# Altium project Dashboard r4.PrjPcb
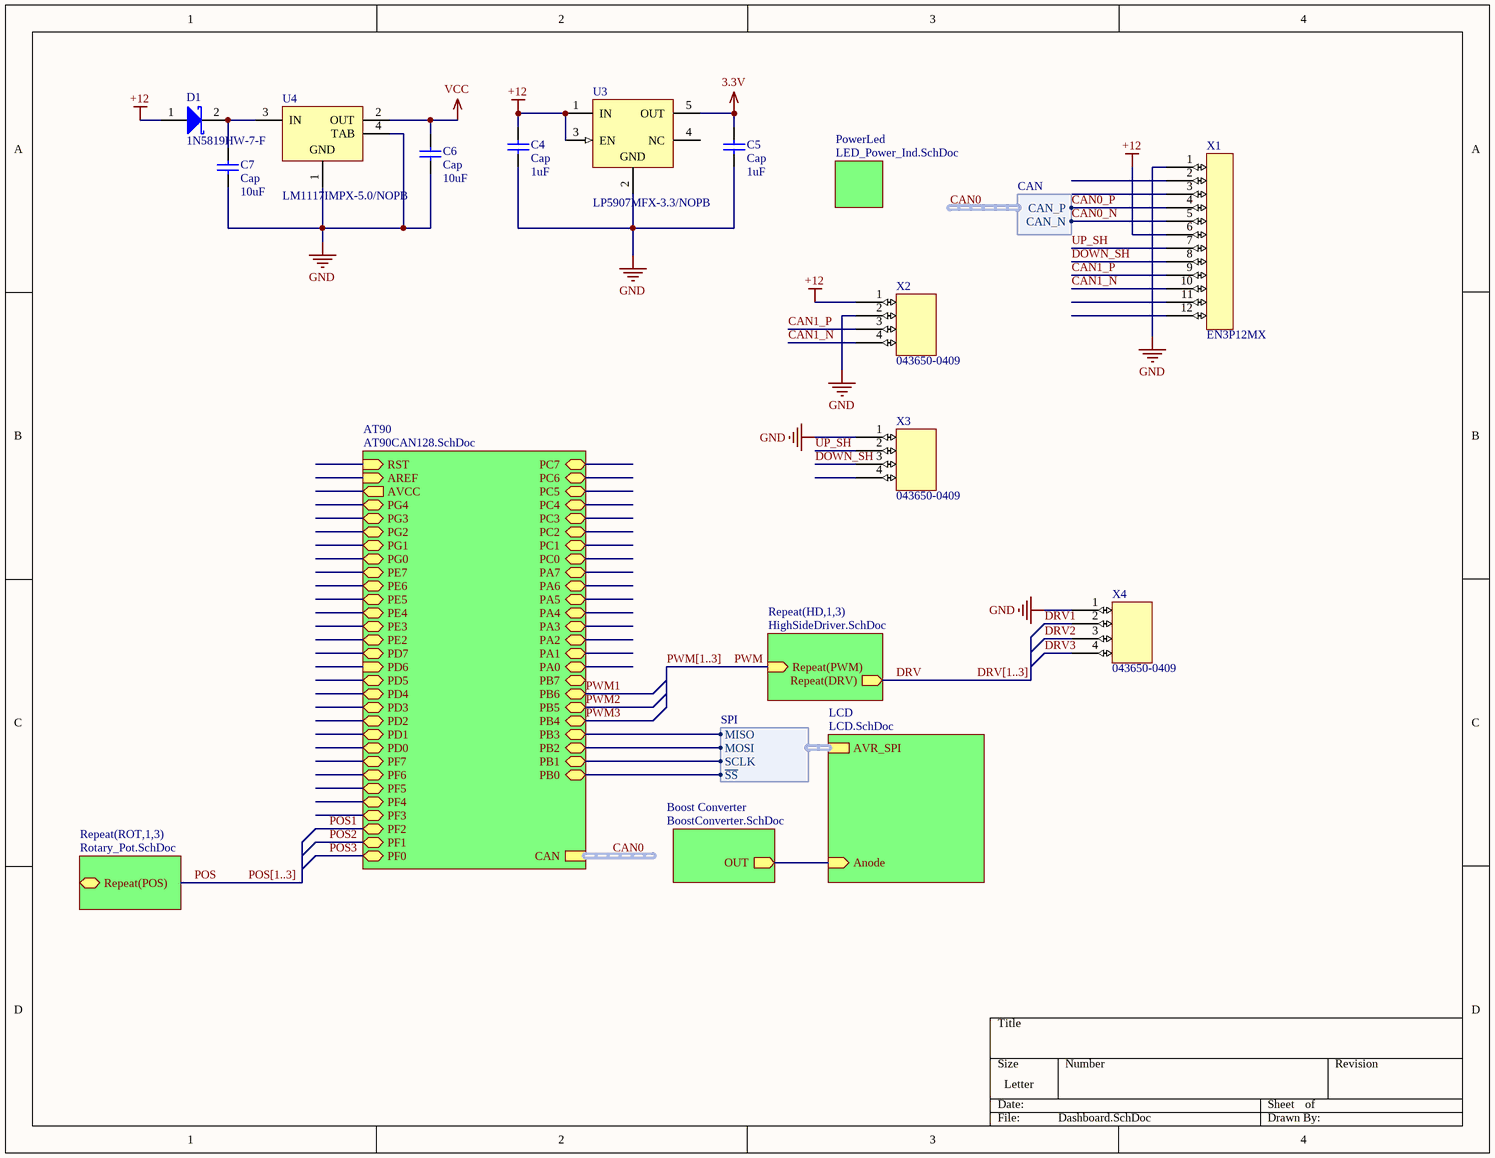
[diagram p0: Dashboard.SchDoc]
9 sheets, 75 parts. Net scope: hierarchical (ports join the sheet entries above them; power ports are global).
Board file: Dashboard.PcbDoc
Sheets:
  Dashboard.SchDoc
    HD1 = HighSideDriver.SchDoc
    HD2 = HighSideDriver.SchDoc
    HD3 = HighSideDriver.SchDoc
    LCD = LCD.SchDoc
    PowerLed = LED_Power_Ind.SchDoc
    AT90 = AT90CAN128.SchDoc
      Int = FTDI_Interface.SchDoc
      CAN = CAN_Interface.SchDoc
      ResetCkt = ResetCkt.SchDoc
    Boost Converter = BoostConverter.SchDoc

## Sheet Dashboard.SchDoc
size Letter

### Parts
C4  Cap  value 1uF  [1608[0603]]
C5  Cap  value 1uF  [1608[0603]]
C6  Cap  value 10uF  [1608[0603]]
C7  Cap  value 10uF  [1608[0603]]
D1  1N5819HW-7-F  [DIOD-SOD-123-2_V]
U3  LP5907MFX-3.3/NOPB  [DBV0005A_L]
U4  LM1117IMPX-5.0/NOPB  [MP04A_M]
X1  EN3P12MX  [EN3P12MX]
X2  043650-0409  [043650-0409]
X3  043650-0409  [043650-0409]
X4  043650-0409  [043650-0409]

### Sub-sheets
AT90 = AT90CAN128.SchDoc: PD6 (in), PD5 (bidir), RST (in), AREF (in), AVCC (out), PG2 (bidir), PG1 (bidir), PG0 (bidir), PE7 (bidir), PE6 (bidir), PE5 (bidir), PE4 (bidir), PE3 (bidir), PE2 (bidir), PD7 (bidir), PD4 (bidir), PD3 (bidir), PD2 (bidir), PD1 (bidir), PD0 (bidir), PF7 (bidir), PF6 (bidir), PF5 (bidir), PF4 (bidir), PF3 (bidir), PF2 (bidir), PF1 (bidir), PF0 (bidir), PC7 (bidir), PC6 (bidir), PC5 (bidir), PC4 (bidir), PC3 (bidir), PC2 (bidir), PC1 (bidir), PC0 (bidir), PA7 (bidir), PA6 (bidir), PA5 (bidir), PA4 (bidir), PA0 (bidir), PG4 (bidir), PA3 (bidir), PA2 (bidir), PB7 (bidir), PB6 (bidir), PA1 (bidir), PG3 (bidir), PB5 (bidir), PB4 (bidir), PB3 (bidir), PB2 (bidir), PB1 (bidir), PB0 (bidir), CAN (harness CAN)
Boost Converter = BoostConverter.SchDoc: OUT (out)
LCD = LCD.SchDoc: Anode (in), AVR_SPI (harness SPI)
PowerLed = LED_Power_Ind.SchDoc: no entries
Repeat(HD,1,3) = HighSideDriver.SchDoc: Repeat(PWM) (in), Repeat(DRV) (out)
Repeat(ROT,1,3) = Rotary_Pot.SchDoc (file not in this document): Repeat(POS) (bidir)

### Harnesses
SPI: ~{SS}, MISO, MOSI, SCLK
CAN: CAN_N, CAN_P

### Nets
3.3V: C5.1 U3.5(OUT)
+12: C4.1 D1.1(A) U3.1(IN) U3.3(EN) X1.6 X2.1
GND: C4.2 C5.2 C6.2 C7.2 U3.2(GND) U4.1(GND) U4.4(TAB) X1.1 X2.2 X3.1 X4.1
VCC: C6.1 U4.2(OUT)
CAN0_N: X1.5 ; sheet AT90/CAN.CAN_N  [project net CAN0.CAN_N]
CAN0_P: X1.4 ; sheet AT90/CAN.CAN_P  [project net CAN0.CAN_P]
CAN1_N: X1.10 X2.4
CAN1_P: X1.9 X2.3
DOWN_SH: X1.8 X3.3
DRV: sheet Repeat(HD,1,3)/Repeat(DRV)
DRV1: X4.2
DRV2: X4.3
DRV3: X4.4
PWM: sheet Repeat(HD,1,3)/Repeat(PWM)
UP_SH: X1.7 X3.2
NetC7_1: C7.1 D1.2(K) U4.3(IN)
NetC17_2: sheet LCD/Anode, sheet Boost Converter/OUT
NetU1#2_10: sheet AT90/PB0, sheet LCD/AVR_SPI.~{SS}
NetU1#2_11: sheet AT90/PB1, sheet LCD/AVR_SPI.SCLK
NetU1#2_12: sheet AT90/PB2, sheet LCD/AVR_SPI.MOSI
NetU1#2_13: sheet AT90/PB3, sheet LCD/AVR_SPI.MISO

Not connected (* = marked no-connect by the designer): U3 4(NC); X1 2 3 11 12; X3 4

### Buses and harness runs
bus DRV[1..3]
bus POS[1..3]
bus PWM[1..3]
harness CAN0 = sheet AT90/CAN

### Library data of the parts
C4-C7 = Cap: Capacitor; Published: 8-Jun-2000; LatestRevisionDate: 17-Jul-2002; LatestRevisionNote: Re-released for DXP Platform.; PackageReference: RAD-0.3; Publisher: Altium Limited; PackageDescription: Radial Cap, Thru-Hole; 2 Leads; 0.3 in Pin Spacing
D1 = CMP-0303-00003-1: 1.0 A Surface Mount Schottky Barrier Rectifier, 40 V, -65 to 125 degC, 2-Pin SOD-123 Package, RoHS, Tape and Reel; Manufacturer: Diodes Inc; @ VR (V): 40; @ Terminal Temperature TT (degC): 90; Maximum Average Rectified Current IO (A): 1; Total Capacitance CT (pF): 50; Peak Forward Surge Current IFSM (A): 25; Forward Voltage Drop VF (V): 0.45; VR (RMS) (V): 28; RoHS: TRUE; PartNumber: 1N5819HW-7-F; ComponentLink2URL: http://www.diodes.com/datasheets/ds30217.pdf; PackageDescription: 2-Pin SOD-123, Body 2.7 x 1.55 mm, Pitch 3.7 mm; @ IF (A): 1; Operating and Storage Temperature Range: -65 to 125 degC; ComponentLink1Description: Manufacturer URL; ComponentLink2Description: Datasheet; ComponentLink1URL: http://www.diodes.com/; Mounting Technology: Surface Mount; DatasheetVersion: Rev. 15-2; PackageReference: SOD-123-2; Maximum Reverse Current IR (uA): 50; Peak Repetitive Reverse Voltage VRRM (V): 40; Packing: Tape and Reel
U3 = CMP-2000-07464-1: Ultra-Low-Noise, Low-IQ LDO, 0.25 A, Fixed 3.3 V Output, 2.2 to 5.5 V Input, -40 to 125 degC, 5-Pin SOT-23 (DBV), Green (RoHS & no Sb/Br), Tape and Reel; Manufacturer: Texas Instruments; Max Output Current: 250mA; Max Input Voltage: 5.5V; Dropout Voltage: 250mV; Number of Regulators: 1; Nominal Output Voltage: 3.3V; Output Voltage Accuracy: 2%; Polarity: Positive; Min Input Voltage: 2.2V; Package Version: 4073253-4/N, 12/2014; Quiescent Current: 425uA; Power Supply Rejection Ratio (PSRR): 82dB; Case\/Package: SOT-23; Lead Free: LeadFree; Package Reference: DBV5; Output Current: 250mA; Package Description: 5-Pin Small Outline Transistor, Body 2.9 x 1.6 mm, Pitch 0.95 mm; Max Operating Temperature: 125degC; Mounting Technology: SurfaceMount; Number of Pins: 5; Mount: SurfaceMount; Manufacturer URL: http://www.ti.com/; Accuracy: 2%; Package URL: http://www.ti.com/lit/ml/mpds018l/mpds018l.pdf; Output Voltage: 3.3V; Radiation Hardening: No; Number of Outputs: 1; Packaging: TapeandReel; RoHSCompliant: true; Min Operating Temperature: -40degC; Datasheet URL: http://www.ti.com/lit/ds/symlink/lp5907.pdf; Package Quantity: 3000; Datasheet Version: Rev. L, 09/2016; REACH SVHC: NoSVHC; Contact Plating: Tin
U4 = CMP-0062-01628-3: 800mA Low-Dropout Linear Regulator, 4-pin SOT-223, Pb-Free; Manufacturer: National Semiconductor; CompType: LDO IC; High-Reliability: Y; PackageTopMarking: XYTT*N06B; PowerWise: N; ComponentLink3Description: LM1117 Web Page; ComponentLink3URL: http://www.national.com/pf/LM/LM1117.html; DatasheetVersion: Apr-2006; ComponentLink2Description: LM1117 Datasheet; PackageVersion: revB, Apr-2003; ComponentLink4Description: MP04A Package Page; ComponentLink1Description: Manufacturer URL; PartNumber: LM1117IMPX-5.0/NOPB; ComponentLink1URL: http://www.national.com/; PackageReference: MP04A; ComponentLink2URL: http://www.national.com/ds/LM/LM1117.pdf; PinCount: 4; Code_JEDEC: TO-261-AA; RevisionNote: SCH symbol layout adjusted; ComponentLink4URL: http://www.national.com/packaging/folders/mp04a.html; RoHS: Y; Code_IPC: SOT223-4; PackageDescription: Molded SOT-223, 6.50 x 3.56 x 1.6mm Body, 4 Lead, 2.3mm Pitch

## Sheet HighSideDriver.SchDoc
size A
Used 3 times, as channels HD1, HD2, HD3. Parts and nets are listed once, with the designators drawn on the sheet.
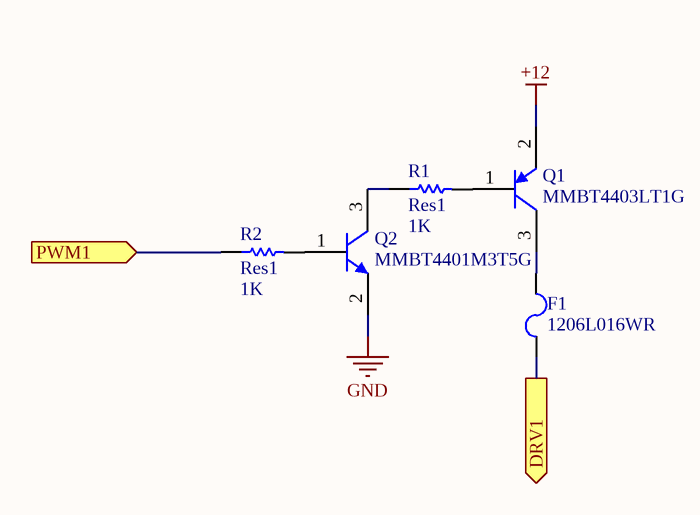
[diagram p1: HighSideDriver.SchDoc]

### Parts
F1  1206L016WR  [LFUS-1206L016WR_V]
Q1  MMBT4403LT1G  [ONSC-SOT-23-3-318-08_V]
Q2  MMBT4401M3T5G  [ONSC-SOT-23-3-318-08_V]
R1  Res1  value 1K  [J1-0603]
R2  Res1  value 1K  [J1-0603]

### Ports
DRV1 (out), PWM1 (in)

### Nets
+12: Q1.2(E)
GND: Q2.2(E)
DRV1: F1.1 ; port DRV1
PWM1: R2.1 ; port PWM1
NetF1_2: F1.2 Q1.3(C)
NetQ1_1: Q1.1(B) R1.2
NetQ2_1: Q2.1(B) R2.2
NetQ2_3: Q2.3(C) R1.1

### Channels
HD1: designators end in _HD1; ports DRV1=NetF1_HD1_1 PWM1=NetR2_HD1_1
HD2: designators end in _HD2; ports DRV1=NetF1_HD2_1 PWM1=NetR2_HD2_1
HD3: designators end in _HD3; ports DRV1=NetF1_HD3_1 PWM1=NetR2_HD3_1

### Library data of the parts
F1 = CMP-2000-05471-1: Resettable Fuse, 30 V, 100 A, 4.5 Ohm, -40 to 85 degC, 1206 (3216 Metric), RoHS, Tape and Reel; Manufacturer: Littelfuse; Hold Current [Ih]: 0.16A; Trip Current: 0.37A; Working Voltage-Max: 30V; Datasheet Version: 08/2016; Size: 1206; Manufacturer URL: http://www.littelfuse.com/; Datasheet URL: http://www.littelfuse.com/~/media/electronics/datasheets/resettable_ptcs/littelfuse_ptc_1206l_datasheet.pdf.pdf; Mounting Technology: SurfaceMount; Package Reference: 1206L016WR; Package Description: 2-Pin Surface Mount Device, Body 3.2 x 1.65 mm, Height 1.45 mm (Max); Operating Temp Range: -40to+85°C
Q1 = CMP-1048-00539-1: Switching Transistor, PNP Silicon, 3-Pin SOT-23, Pb-Free, Tape and Reel; Manufacturer: On Semiconductor; fT Min (MHz): 200; IC Continuous (A): -0.6; ComponentLink1URL: http://www.onsemi.com/; ComponentLink2URL: http://www.onsemi.cn/pub_link/Collateral/MMBT4403LT1-D.PDF; PackageVersion: Rev. AP, 11/2009; ComponentLink1Description: Manufacturer URL; PackageDescription: 3-Pin Small Outline Transistor, Body 2.92 x 1.3 mm, Pitch 0.95 mm; Polarity: PNP; ComponentLink3Description: Package Specification; DatasheetVersion: Rev. 12; Mounting Technology: Surface Mount; PackageReference: SOT-23-3-318-08; ComponentLink3URL: http://www.onsemi.cn/pub_link/Collateral/318-08.PDF; Packing: Tape and Reel; PartNumber: MMBT4403LT1G; RoHS: TRUE; ComponentLink2Description: Datasheet
Q2 = CMP-1048-00548-1: Switching Transistor, NPN Silicon, 3-Pin SOT-23, Pb-Free, Tape and Reel; Manufacturer: On Semiconductor; PartNumber: MMBT4401LT3G; fT Min (MHz): 250; IC Continuous (A): 0.6; PackageReference: SOT-23-3-318-08; ComponentLink2Description: Datasheet; DatasheetVersion: Rev. 10; ComponentLink3Description: Package Specification; RoHS: TRUE; Packing: Tape and Reel; ComponentLink1Description: Manufacturer URL; ComponentLink1URL: http://www.onsemi.com/; Mounting Technology: Surface Mount; ComponentLink2URL: http://www.onsemi.cn/pub_link/Collateral/MMBT4401LT1-D.PDF; ComponentLink3URL: http://www.onsemi.cn/pub_link/Collateral/318-08.PDF; PackageVersion: Rev. AP, 11/2009; PackageDescription: 3-Pin Small Outline Transistor, Body 2.92 x 1.3 mm, Pitch 0.95 mm; Polarity: NPN
R1 R2 = Res1: Resistor; Published: 8-Jun-2000; LatestRevisionDate: 17-Jul-2002; LatestRevisionNote: Re-released for DXP Platform.; PackageReference: AXIAL-0.3; Publisher: Altium Limited; PackageDescription: Axial Device, Thru-Hole; 2 Leads; 0.3 in Pin Spacing

## Sheet LCD.SchDoc
size A
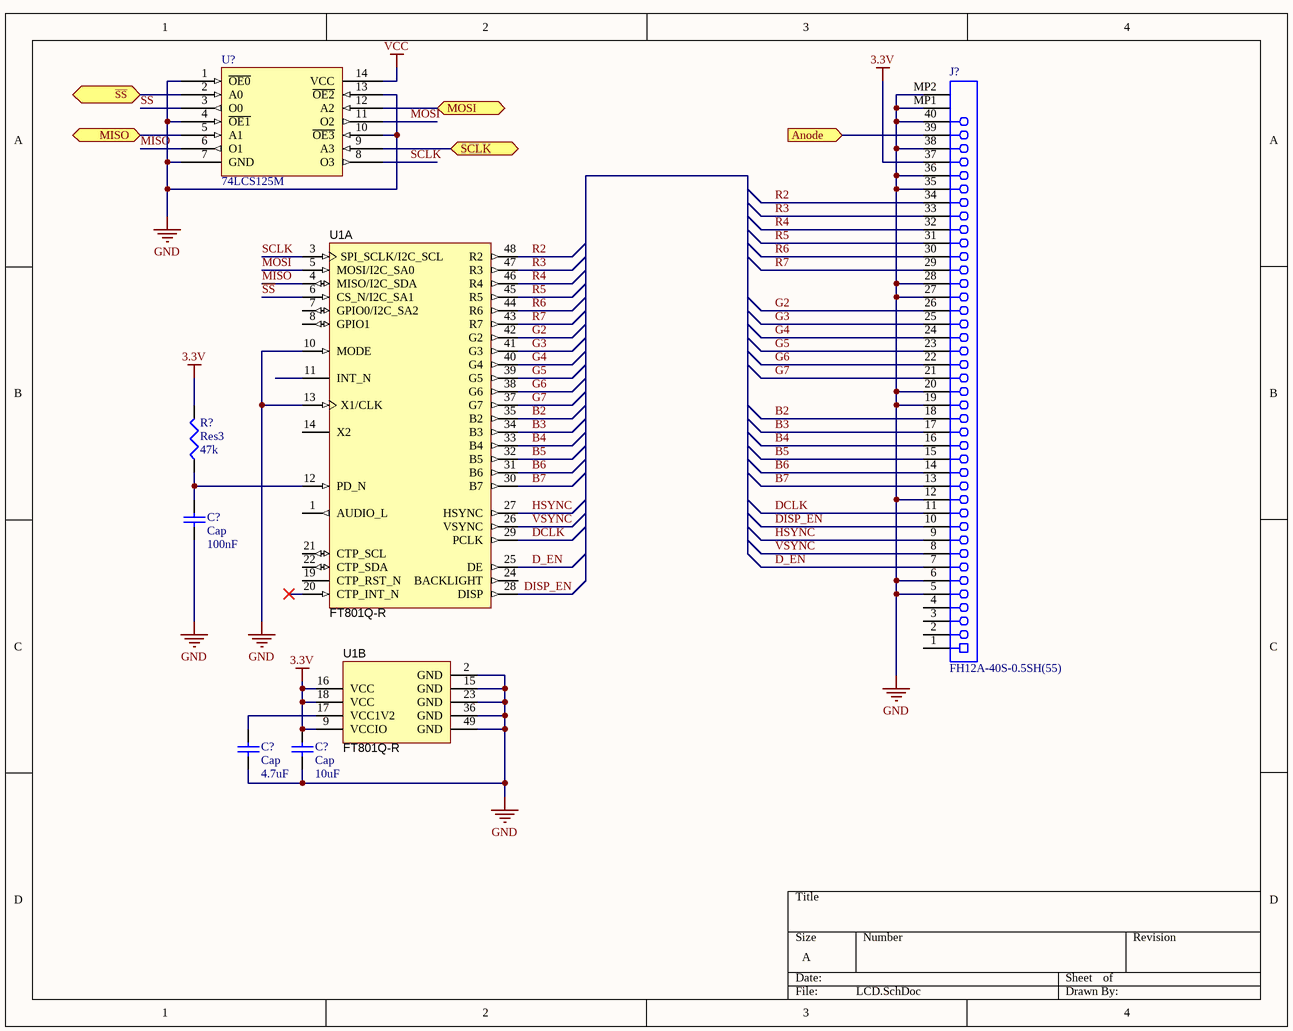
[diagram p2: LCD.SchDoc]

### Parts
(Parts that share a designator on the sheet are numbered #1, #2 ... from top to bottom, then left to right.)
C21  Cap  value 4.7uF  [C0805]
C22  Cap  value 10uF  [1608[0603]]
C23  Cap  value 100nF  [C0805]
J1  FH12A-40S-0.5SH(55)  [HIRO-FH12A-40S-0.5SH(55)_V]
R13  Res3  value 47k  [J1-0603]
U1#1  FT801Q-R  [WQFN-48]  (parts A,B of 2)
U7  74LCS125M  [SOIC127P780X210-14M]

### Ports
Anode (in), MISO (bidir), MOSI (bidir), SCLK (bidir), ~{SS} (bidir)

### Nets
3.3V: C22.1 J1.37 R13.2 U1#1.9(VCCIO) U1#1.16(VCC) U1#1.18(VCC)
GND: C21.1 C22.2 C23.1 J1.5 J1.6 J1.12 J1.19 J1.20 J1.27 J1.28 J1.35 J1.36 J1.38 J1.40 J1.MP1 J1.MP2 U1#1.2(GND) U1#1.10(MODE) U1#1.13(X1/CLK) U1#1.15(GND) U1#1.23(GND) U1#1.36(GND) U1#1.49(GND) U7.1(~{OE0}) U7.4(~{OE1}) U7.7(GND) U7.10(~{OE3}) U7.13(~{OE2})
VCC: U7.14(VCC)
B2: J1.18 U1#1.35(B2)
B3: J1.17 U1#1.34(B3)
B4: J1.16 U1#1.33(B4)
B5: J1.15 U1#1.32(B5)
B6: J1.14 U1#1.31(B6)
B7: J1.13 U1#1.30(B7)
D_EN: J1.7 U1#1.25(DE)
DCLK: J1.11 U1#1.29(PCLK)
DISP_EN: J1.10 U1#1.28(DISP)
G2: J1.26 U1#1.42(G2)
G3: J1.25 U1#1.41(G3)
G4: J1.24 U1#1.40(G4)
G5: J1.23 U1#1.39(G5)
G6: J1.22 U1#1.38(G6)
G7: J1.21 U1#1.37(G7)
HSYNC: J1.9 U1#1.27(HSYNC)
MISO: U1#1.4(MISO/I2C_SDA) U7.6(O1)
MOSI: U1#1.5(MOSI/I2C_SA0) U7.11(O2)
R2: J1.34 U1#1.48(R2)
R3: J1.33 U1#1.47(R3)
R4: J1.32 U1#1.46(R4)
R5: J1.31 U1#1.45(R5)
R6: J1.30 U1#1.44(R6)
R7: J1.29 U1#1.43(R7)
~{SS}: U1#1.6(CS_N/I2C_SA1) U7.3(O0)
SCLK: U1#1.3(SPI_SCLK/I2C_SCL) U7.8(O3)
VSYNC: J1.8 U1#1.26(VSYNC)
NetC17_2: J1.39 ; port Anode
NetC21_2: C21.2 U1#1.17(VCC1V2)
NetC23_2: C23.2 R13.1 U1#1.12(PD_N)
NetU7_2: U7.2(A0) ; port ~{SS}
NetU7_5: U7.5(A1) ; port MISO
NetU7_9: U7.9(A3) ; port SCLK
NetU7_12: U7.12(A2) ; port MOSI

Not connected (* = marked no-connect by the designer): J1 1 2 3 4; U1#1 1(AUDIO_L) 7(GPIO0/I2C_SA2) 8(GPIO1) 11(INT_N) 14(X2) 19(CTP_RST_N) 20(CTP_INT_N)* 21(CTP_SCL) 22(CTP_SDA) 24(BACKLIGHT)

### Library data of the parts
C21-C23 = Cap: Capacitor; Published: 8-Jun-2000; LatestRevisionDate: 17-Jul-2002; LatestRevisionNote: Re-released for DXP Platform.; PackageReference: RAD-0.3; Publisher: Altium Limited; PackageDescription: Radial Cap, Thru-Hole; 2 Leads; 0.3 in Pin Spacing
J1 = CMP-2000-06268-1: Flip Lock Conncetor for FPC/FFC, 1 x 40 Position, Pitch 0.5 mm, -40 to 70 degC, SMD, RoHS, Tape and Reel; Manufacturer: Hirose Electric; Pitch: 0.5mm; Style/Orientation: RightAngleSocket/Receptacle; No of Positions: 40; Package Description: Female Header, Pitch 0.5 mm, 1 x 40 Position, Height 2 mm; Datasheet Version: 10/2006; Termination: Solder; Manufacturer URL: https://www.hirose.com; Mounting Technology: SurfaceMount; Type: FFC/FPC; Package Reference: FH12A-40S-0.5SH(55); Datasheet URL: https://datasheet.ciiva.com/14667/0900766b80806912-14667338.pdf
R13 = Res3: Resistor; Published: 8-Jun-2000; LatestRevisionDate: 29-May-2009; LatestRevisionNote: IPC-7351 Footprint Added.; PackageReference: J1-0603; Publisher: Altium Limited; PackageDescription: Chip Resistor
U1#1 = CMP-0582-00009-1: FT801 Single Chip Embedded Graphic Controller (Embedded Video Engine), -40 to +85 degC, 48-pin VQFN, Pb-Free, Tape and Reel; Manufacturer: FTDI; PackageReference: WQFN-48; ComponentLink1URL: http://www.ftdichip.com/; PackageDescription: 48-Pin Quad Flat No-Lead, 7 x 7 mm Body, 0.5 mm Pitch, 5.36 x 5.36 mm Exposed Pad; ComponentLink1Description: Manufacturer URL; ComponentLink2URL: http://www.ftdichip.com/Support/Documents/DataSheets/ICs/DS_FT801.pdf; DatasheetVersion: ver 1.0, Jul-2014; ComponentLink2Description: Datasheet
U7 = 74LCS125M: Low Voltage Quad Buffer with 5V tolerant Inputs and Outputs; ComponentLink1Description: Digikey Link; ComponentLink1URL: https://www.digikey.com/product-detail/en/on-semiconductor/74LCX125MX/74LCX125MXCT-ND/965496

## Sheet LED_Power_Ind.SchDoc
size A
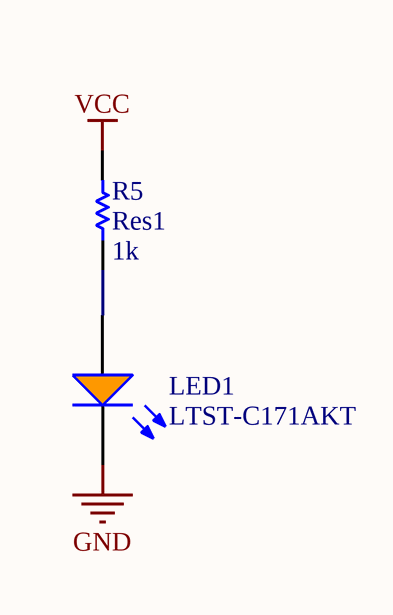
[diagram p3: LED_Power_Ind.SchDoc]

### Parts
LED1  LTST-C171AKT  [LTST-C171AKT_V]
R5  Res1  value 1k  [6-0805_L]

### Nets
GND: LED1.2(K)
VCC: R5.2
NetLED1_1: LED1.1(A) R5.1

### Library data of the parts
LED1 = CMP-1674-00004-5: LED Uni-Color Orange, 100 mW, 120 mA, -55 to 85 degC, 2-Pin SMD, RoHS, Tape and Reel; Manufacturer: Lite-On; ComponentLink1URL: http://www.us.liteon.com/; ComponentLink2Description: Datasheet; Packaging: Tape and Reel; Mount: Surface Mount; RoHSCompliant: true; Colour: Orange; Min Operating Temperature: -55 degC; ComponentLink2URL: http://optoelectronics.liteon.com/upload/download/DS-22-99-0170/S_110_LTST-C171AKT.pdf; Package Quantity: 3000; Height: 0.8 mm; Max Operating Temperature: 85 degC; ComponentLink1Description: Manufacturer URL; PackageReference: C171AKT; PackageDescription: 2-Pin Surface Mount Device, Body 2 x 1.25 mm; DatasheetVersion: 03/2014; Length: 2 mm; Mounting Technology: Surface Mount; Pins: 2
R5 = Res1: Resistor; Published: 8-Jun-2000; LatestRevisionDate: 17-Jul-2002; LatestRevisionNote: Re-released for DXP Platform.; PackageReference: AXIAL-0.3; Publisher: Altium Limited; PackageDescription: Axial Device, Thru-Hole; 2 Leads; 0.3 in Pin Spacing

## Sheet AT90CAN128.SchDoc
size A
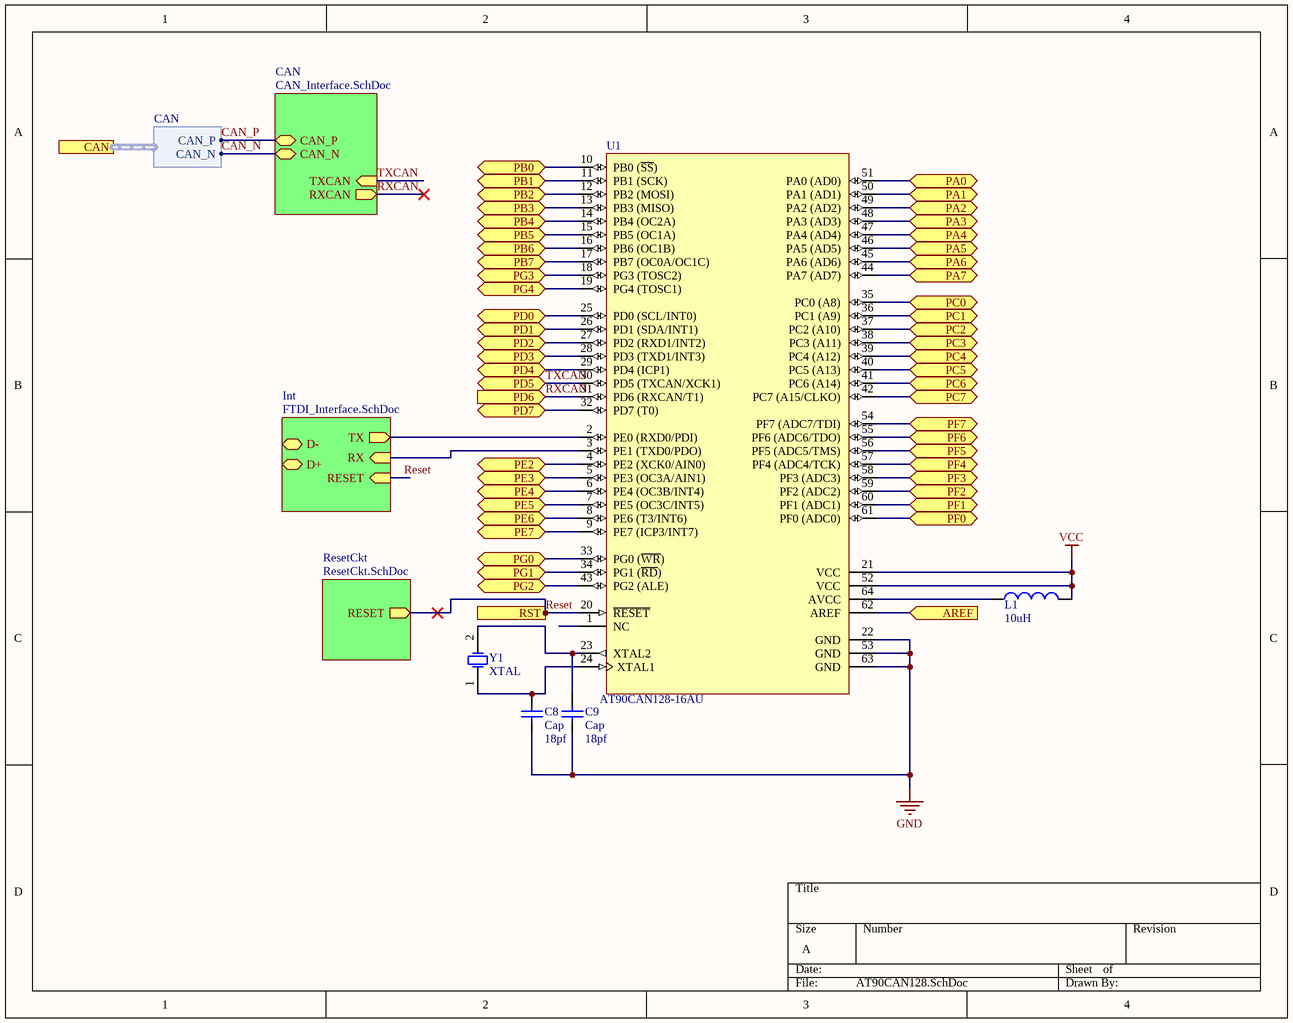
[diagram p4: AT90CAN128.SchDoc]

### Parts
(Parts that share a designator on the sheet are numbered #1, #2 ... from top to bottom, then left to right.)
C8  Cap  value 18pf  [C0805]
C9  Cap  value 18pf  [C0805]
L1  10uH  [INDC3216]
U1#2  AT90CAN128-16AU  [64A_M]
Y1  XTAL  [6-0805_L]

### Sub-sheets
CAN = CAN_Interface.SchDoc: CAN_P (bidir), CAN_N (bidir), TXCAN (in), RXCAN (out)
Int = FTDI_Interface.SchDoc: D- (bidir), D+ (bidir), TX (out), RX (in), RESET (in)
ResetCkt = ResetCkt.SchDoc: RESET (out)

### Ports
AREF (in), CAN (harness CAN), PA0 (bidir), PA1 (bidir), PA2 (bidir), PA3 (bidir), PA4 (bidir), PA5 (bidir), PA6 (bidir), PA7 (bidir), PB0 (bidir), PB1 (bidir), PB2 (bidir), PB3 (bidir), PB4 (bidir), PB5 (bidir), PB6 (bidir), PB7 (bidir), PC0 (bidir), PC1 (bidir), PC2 (bidir), PC3 (bidir), PC4 (bidir), PC5 (bidir), PC6 (bidir), PC7 (bidir), PD0 (bidir), PD1 (bidir), PD2 (bidir), PD3 (bidir), PD4 (bidir), PD5 (bidir), PD6 (in), PD7 (bidir), PE2 (bidir), PE3 (bidir), PE4 (bidir), PE5 (bidir), PE6 (bidir), PE7 (bidir), PF0 (bidir), PF1 (bidir), PF2 (bidir), PF3 (bidir), PF4 (bidir), PF5 (bidir), PF6 (bidir), PF7 (bidir), PG0 (bidir), PG1 (bidir), PG2 (bidir), PG3 (bidir), PG4 (bidir), RST (in)

### Harnesses
CAN: CAN_P, CAN_N

### Nets
GND: C8.1 C9.1 U1#2.22(GND) U1#2.53(GND) U1#2.63(GND)
VCC: L1.2 U1#2.21(VCC) U1#2.52(VCC)
CAN_N: sheet CAN/CAN_N, port CAN.CAN_N  [project net CAN0.CAN_N]
CAN_P: sheet CAN/CAN_P, port CAN.CAN_P  [project net CAN0.CAN_P]
POS1: U1#2.59(PF2_(ADC2)) ; port PF2
POS2: U1#2.60(PF1_(ADC1)) ; port PF1
POS3: U1#2.61(PF0_(ADC0)) ; port PF0
PWM1: U1#2.16(PB6_(OC1B)) ; port PB6
PWM2: U1#2.15(PB5_(OC1A)) ; port PB5
PWM3: U1#2.14(PB4_(OC2A)) ; port PB4
Reset: U1#2.20(~{RESET}) ; port RST, sheet Int/RESET, sheet ResetCkt/RESET
RXCAN: U1#2.31(PD6_(RXCAN/T1)) ; port PD6, sheet CAN/RXCAN
TXCAN: U1#2.30(PD5_(TXCAN/XCK1)) ; port PD5, sheet CAN/TXCAN
NetC8_2: C8.2 U1#2.24(XTAL1) Y1.1(OSC1)
NetC9_2: C9.2 U1#2.23(XTAL2) Y1.2(OSC2)
NetL1_1: L1.1 U1#2.64(AVCC)
NetR3_2: U1#2.2(PE0_(RXD0/PDI)) ; sheet Int/TX
NetR4_2: U1#2.3(PE1_(TXD0/PDO)) ; sheet Int/RX
NetU1#2_4: U1#2.4(PE2_(XCK0/AIN0)) ; port PE2
NetU1#2_5: U1#2.5(PE3_(OC3A/AIN1)) ; port PE3
NetU1#2_6: U1#2.6(PE4_(OC3B/INT4)) ; port PE4
NetU1#2_7: U1#2.7(PE5_(OC3C/INT5)) ; port PE5
NetU1#2_8: U1#2.8(PE6_(T3/INT6)) ; port PE6
NetU1#2_9: U1#2.9(PE7_(ICP3/INT7)) ; port PE7
NetU1#2_10: U1#2.10(PB0_(~{SS})) ; port PB0
NetU1#2_11: U1#2.11(PB1_(SCK)) ; port PB1
NetU1#2_12: U1#2.12(PB2_(MOSI)) ; port PB2
NetU1#2_13: U1#2.13(PB3_(MISO)) ; port PB3
NetU1#2_17: U1#2.17(PB7_(OC0A/OC1C)) ; port PB7
NetU1#2_18: U1#2.18(PG3_(TOSC2)) ; port PG3
NetU1#2_19: U1#2.19(PG4_(TOSC1)) ; port PG4
NetU1#2_25: U1#2.25(PD0_(SCL/INT0)) ; port PD0
NetU1#2_26: U1#2.26(PD1_(SDA/INT1)) ; port PD1
NetU1#2_27: U1#2.27(PD2_(RXD1/INT2)) ; port PD2
NetU1#2_28: U1#2.28(PD3_(TXD1/INT3)) ; port PD3
NetU1#2_29: U1#2.29(PD4_(ICP1)) ; port PD4
NetU1#2_32: U1#2.32(PD7_(T0)) ; port PD7
NetU1#2_33: U1#2.33(PG0_(~{WR})) ; port PG0
NetU1#2_34: U1#2.34(PG1_(~{RD})) ; port PG1
NetU1#2_35: U1#2.35(PC0_(A8)) ; port PC0
NetU1#2_36: U1#2.36(PC1_(A9)) ; port PC1
NetU1#2_37: U1#2.37(PC2_(A10)) ; port PC2
NetU1#2_38: U1#2.38(PC3_(A11)) ; port PC3
NetU1#2_39: U1#2.39(PC4_(A12)) ; port PC4
NetU1#2_40: U1#2.40(PC5_(A13)) ; port PC5
NetU1#2_41: U1#2.41(PC6_(A14)) ; port PC6
NetU1#2_42: U1#2.42(PC7_(A15/CLKO)) ; port PC7
NetU1#2_43: U1#2.43(PG2_(ALE)) ; port PG2
NetU1#2_44: U1#2.44(PA7_(AD7)) ; port PA7
NetU1#2_45: U1#2.45(PA6_(AD6)) ; port PA6
NetU1#2_46: U1#2.46(PA5_(AD5)) ; port PA5
NetU1#2_47: U1#2.47(PA4_(AD4)) ; port PA4
NetU1#2_48: U1#2.48(PA3_(AD3)) ; port PA3
NetU1#2_49: U1#2.49(PA2_(AD2)) ; port PA2
NetU1#2_50: U1#2.50(PA1_(AD1)) ; port PA1
NetU1#2_51: U1#2.51(PA0_(AD0)) ; port PA0
NetU1#2_54: U1#2.54(PF7_(ADC7/TDI)) ; port PF7
NetU1#2_55: U1#2.55(PF6_(ADC6/TDO)) ; port PF6
NetU1#2_56: U1#2.56(PF5_(ADC5/TMS)) ; port PF5
NetU1#2_57: U1#2.57(PF4_(ADC4/TCK)) ; port PF4
NetU1#2_58: U1#2.58(PF3_(ADC3)) ; port PF3
NetU1#2_62: U1#2.62(AREF) ; port AREF

Not connected (* = marked no-connect by the designer): U1#2 1(NC)

### Library data of the parts
C8 C9 = Cap: Capacitor; Published: 8-Jun-2000; LatestRevisionDate: 17-Jul-2002; LatestRevisionNote: Re-released for DXP Platform.; PackageReference: RAD-0.3; Publisher: Altium Limited; PackageDescription: MLCC_0805
L1 = Inductor: Code_IEC: 1005; Published: 8-Jun-2000; LatestRevisionDate: 29-May-2009; LatestRevisionNote: IPC-7351 Footprint Added.; PackageReference: 0402-A; Publisher: Altium Limited; PackageDescription: Chip Inductor; Code_JEITA: 0402
U1#2 = CMP-0096-00104-2: 8-bit AVR Microcontroller, 128KB Flash and CAN Controller, 53 GPIO pins, Industrial Grade (-40° to +85°C), 64-pin LQFP, Green; PackageVersion: revC, Oct-2010; ComponentLink1Description: Manufacturer URL; ComponentLink3Description: AT90CAN32/64/128 Summary; ComponentLink2Description: AT90CAN32/64/128 Datasheet; Code_JEDEC: MS-026-AEB; DatasheetVersion: revH, Aug-2008; ComponentLink2URL: http://www.atmel.com/dyn/resources/prod_documents/doc7679.pdf; ComponentLink3URL: http://www.atmel.com/dyn/resources/prod_documents/7679S.pdf; ComponentLink1URL: http://www.atmel.com/; RevisionNote: PackageVersion updated. URLs added.; PackageReference: 64A; PackageDescription: 64-Pin Plastic Thin Profile Quad Flat Pack, 14 x 14 x 1.0 mm Body, 0.8 mm Pitch (TQFP)
Y1 = XTAL: Crystal Oscillator; Published: 8-Jun-2000; LatestRevisionDate: 17-Jul-2002; LatestRevisionNote: Re-released for DXP Platform.; PackageReference: R38; Publisher: Altium Limited; PackageDescription: Crystal, Thru-Hole; 2 Leads; Body 3.1 x 8.2 mm (Dia.xH)

## Sheet FTDI_Interface.SchDoc
size A
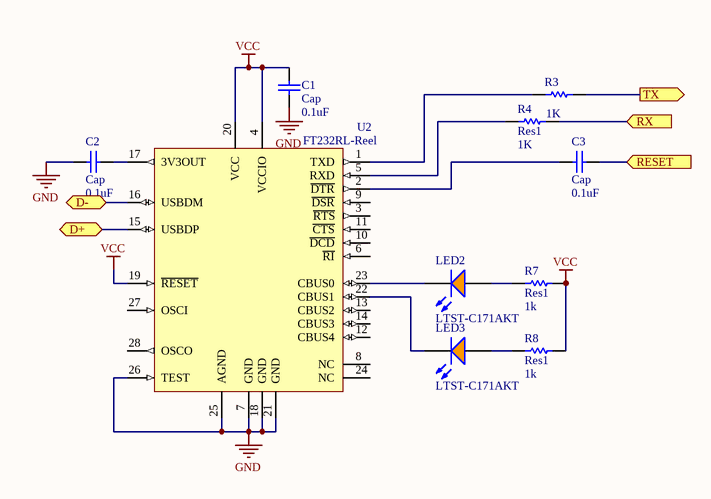
[diagram p5: FTDI_Interface.SchDoc]

### Parts
C1  Cap  value 0.1uF  [C0805]
C2  Cap  value 0.1uF  [C0805]
C3  Cap  value 0.1uF  [C0805]
LED2  LTST-C171AKT  [LTST-C171AKT_V]
LED3  LTST-C171AKT  [LTST-C171AKT_V]
R3  value 1K  [6-0805_L]  (hidden comment: Res1)
R4  Res1  value 1K  [6-0805_L]
R7  Res1  value 1k  [6-0805_L]
R8  Res1  value 1k  [6-0805_L]
U2  FT232RL-Reel  [SSOP-28_L]

### Ports
D+ (bidir), D- (bidir), RESET (in), RX (in), TX (out)

### Nets
GND: C1.1 C2.1 U2.7(GND) U2.18(GND) U2.21(GND) U2.25(AGND) U2.26(TEST)
VCC: C1.2 R7.2 R8.2 U2.4(VCCIO) U2.19(~{RESET}) U2.20(VCC)
Reset: C3.1 ; port RESET
NetC2_2: C2.2 U2.17(3V3OUT)
NetC3_2: C3.2 U2.2(~{DTR})
NetLED2_1: LED2.1(A) R7.1
NetLED2_2: LED2.2(K) U2.23(CBUS0)
NetLED3_1: LED3.1(A) R8.1
NetLED3_2: LED3.2(K) U2.22(CBUS1)
NetR3_1: R3.1 U2.1(TXD)
NetR3_2: R3.2 ; port TX
NetR4_1: R4.1 U2.5(RXD)
NetR4_2: R4.2 ; port RX
NetU2_15: U2.15(USBDP) ; port D+
NetU2_16: U2.16(USBDM) ; port D-

Not connected (* = marked no-connect by the designer): U2 3(~{RTS}) 6(~{RI}) 8(NC) 9(~{DSR}) 10(~{DCD}) 11(~{CTS}) 12(CBUS4) 13(CBUS2) 14(CBUS3) 24(NC) 27(OSCI) 28(OSCO)

### Library data of the parts
C1-C3 = Cap: Capacitor; Published: 8-Jun-2000; LatestRevisionDate: 17-Jul-2002; LatestRevisionNote: Re-released for DXP Platform.; PackageReference: RAD-0.3; Publisher: Altium Limited; PackageDescription: Radial Cap, Thru-Hole; 2 Leads; 0.3 in Pin Spacing
LED2 LED3 = CMP-1674-00004-5: as LED1 on sheet LED_Power_Ind; ComponentLink1URL: http://www.us.liteon.com/; ComponentLink2Description: Datasheet; Packaging: Tape and Reel; Mount: Surface Mount; RoHSCompliant: true; Colour: Orange; Min Operating Temperature: -55 degC; ComponentLink2URL: http://optoelectronics.liteon.com/upload/download/DS-22-99-0170/S_110_LTST-C171AKT.pdf; Package Quantity: 3000; Height: 0.8 mm; Max Operating Temperature: 85 degC; ComponentLink1Description: Manufacturer URL; PackageReference: C171AKT; PackageDescription: 2-Pin Surface Mount Device, Body 2 x 1.25 mm; DatasheetVersion: 03/2014; Length: 2 mm; Mounting Technology: Surface Mount; Pins: 2
R3 R4 R7 R8 = Res1: Resistor; Published: 8-Jun-2000; LatestRevisionDate: 17-Jul-2002; LatestRevisionNote: Re-released for DXP Platform.; PackageReference: AXIAL-0.3; Publisher: Altium Limited; PackageDescription: Axial Device, Thru-Hole; 2 Leads; 0.3 in Pin Spacing
U2 = CMP-0078-00029-3: USB UART Asynchronous Serial Data Transfer Chip, 28-pin SSOP, Tape and Reel; Manufacturer: FTDI; PackageVersion: Mar-12; PackageReference: SSOP-28; ComponentLink2Description: Datasheet; DatasheetVersion: ver 2.10, Mar-2012; PackageDescription: 28-Pin Small Outline Package 0.65 mm Pitch; ComponentLink1Description: Manufacturer URL; RevisionNote: DatasheetVersion updated to 2.10 Mar-2012; PartNumber: FT232RL-Reel; ComponentLink1URL: http://www.ftdichip.com/; ComponentLink2URL: http://www.ftdichip.com/Support/Documents/DataSheets/ICs/DS_FT232R.pdf

## Sheet CAN_Interface.SchDoc
size A
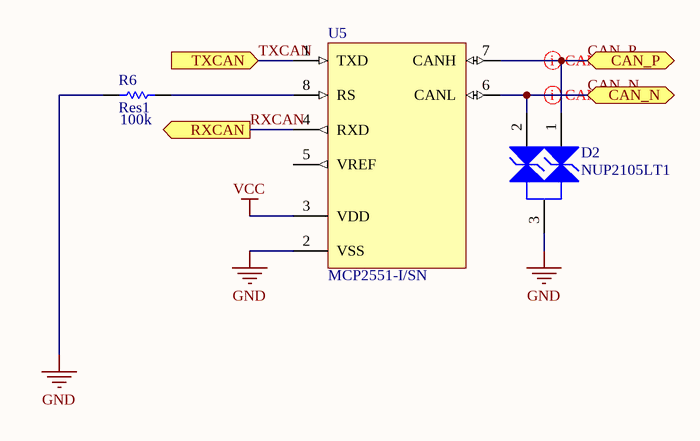
[diagram p6: CAN_Interface.SchDoc]

### Parts
D2  NUP2105LT1  [ONSC-SOT-23-3-318-08_V]
R6  Res1  value 100k  [6-0805_L]
U5  MCP2551-I/SN  [SOIC-SN8_N]

### Ports
CAN_N (bidir), CAN_P (bidir), RXCAN (out), TXCAN (in)

### Nets
GND: D2.3(K) R6.1 U5.2(VSS)
VCC: U5.3(VDD)
CAN_N: D2.2(K) U5.6(CANL) ; port CAN_N  [project net CAN0.CAN_N]
CAN_P: D2.1(K) U5.7(CANH) ; port CAN_P  [project net CAN0.CAN_P]
RXCAN: U5.4(RXD) ; port RXCAN
TXCAN: U5.1(TXD) ; port TXCAN
NetR6_2: R6.2 U5.8(RS)

Not connected (* = marked no-connect by the designer): U5 5(VREF)

### Layout directives
differential pair; rule Matched Net Lengths [Tolerance = 1000mil]: CAN0.CAN_P
differential pair: CAN0.CAN_N

### Library data of the parts
D2 = CMP-1063-00165-1: Dual Line CAN Bus Protector, 3-Pin SOT-23, Tape and Reel; Manufacturer: On Semiconductor; PPK Max (W): 350; IR Max (uA): 0.1; Number of Lines: 2; V(BR) Min (V): 26.2; Direction: Bidirectional; C Max (pF): 30; PackageDescription: 3-Pin Small Outline Transistor, Body 2.92 x 1.3 mm, Pitch 0.95 mm; ComponentLink2URL: http://www.onsemi.cn/pub_link/Collateral/NUP2105L-D.PDF; ComponentLink3Description: Package Specification; ComponentLink2Description: Datasheet; ComponentLink1URL: http://www.onsemi.com/; Mounting Technology: Surface Mount; ComponentLink1Description: Manufacturer URL; Packing: Tape and Reel; PackageVersion: Rev. AP, 11/2009; PartNumber: NUP2105LT1; DatasheetVersion: Rev. 5; ComponentLink3URL: http://www.onsemi.cn/pub_link/Collateral/318-08.PDF; PackageReference: SOT-23-3-318-08
R6 = Res1: Resistor; Published: 8-Jun-2000; LatestRevisionDate: 17-Jul-2002; LatestRevisionNote: Re-released for DXP Platform.; PackageReference: AXIAL-0.3; Publisher: Altium Limited; PackageDescription: Axial Device, Thru-Hole; 2 Leads; 0.3 in Pin Spacing
U5 = CMP-0186-00138-2: High-Speed CAN Transceiver, 8-Pin SOIC, Industrial Temperature; Code_JEDEC: MS-012; ComponentLink3URL: http://www.microchip.com/stellent/groups/techpub_sg/documents/packagingspec/en012702.pdf; DatasheetVersion: revF, Jul-2010; PackageVersion: revBB, Aug-2009; PackageDescription: 8-Lead Plastic Small Outline (SN) - Narrow, 3.90mm Body [SOIC]; ComponentLink1URL: http://www.microchip.com/; ComponentLink3Description: Package Specification; ComponentLink2Description: Datasheet; Code_IPC: SOIC127P600-8; ComponentLink1Description: Manufacturer URL; PackageReference: SOIC-SN8; ComponentLink2URL: http://ww1.microchip.com/downloads/en/DeviceDoc/21667F.pdf; RevisionNote: URLs added. DatasheetVersion updated.

## Sheet ResetCkt.SchDoc
size A
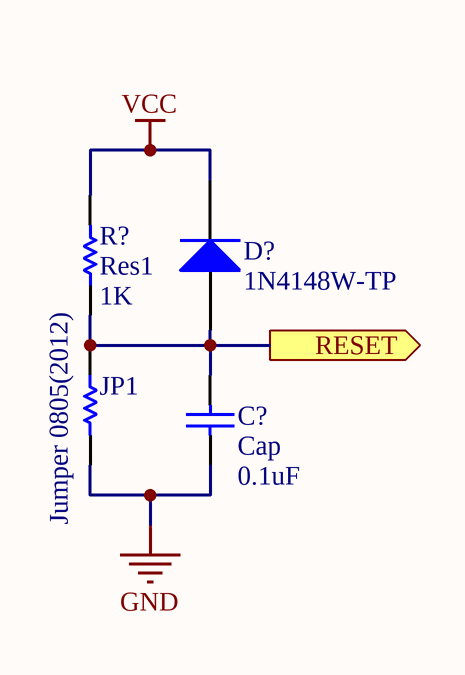
[diagram p7: ResetCkt.SchDoc]

### Parts
C24  Cap  value 0.1uF  [C0805]
D4  1N4148W-TP  [MCC-SOD123_V]
JP1  Jumper 0805(2012)  [RESC0805(2012)_N]
R14  Res1  value 1K  [6-0805_L]

### Ports
RESET (out)

### Nets
GND: C24.1 JP1.2
VCC: D4.2(K) R14.2
Reset: C24.2 D4.1(A) JP1.1 R14.1 ; port RESET

### Library data of the parts
C24 = Cap: Capacitor; Published: 8-Jun-2000; LatestRevisionDate: 17-Jul-2002; LatestRevisionNote: Re-released for DXP Platform.; PackageReference: RAD-0.3; Publisher: Altium Limited; PackageDescription: MLCC_0805
D4 = CMP-2000-04993-1: High Speed Switching Diode, 400 mW, 150 mA, -65 to 150 degC, 2-Pin SOD123, RoHS, Tape and Reel; Manufacturer: Micro Commercial Components; Reverse Recovery Time-Max: 4ns; Average Forward Current-Max: 0.15A; Peak Current-Max: 2A; Power Dissipation: 400mW; Reverse Voltage-Max [Vrrm]: 100V; Datasheet URL: https://datasheet.ciiva.com/16836/1n4148wsod123-16836277.pdf; Package Reference: SOD123; Package URL: http://www.mccsemi.com/up_pdf/1N4448W(SOD-123).pdf; Package Description: 2-Pin Small Outline Diode, Body 2.7 x 1.6 mm, Height 1.35 mm; Manufacturer URL: http://www.mccsemi.com/; Datasheet Version: Rev. C, 07/2014
JP1 = CMP-1013-00001-1: Jumper 0805 (2012 Metric); Case-EIA: 0805; Value: 0.00 Ohm; Tolerance: None; Case-Metric: 2012; Technology: SMT; Power: None
R14 = Res1: Resistor; Published: 8-Jun-2000; LatestRevisionDate: 17-Jul-2002; LatestRevisionNote: Re-released for DXP Platform.; PackageReference: AXIAL-0.3; Publisher: Altium Limited; PackageDescription: Axial Device, Thru-Hole; 2 Leads; 0.3 in Pin Spacing

## Sheet BoostConverter.SchDoc
size A
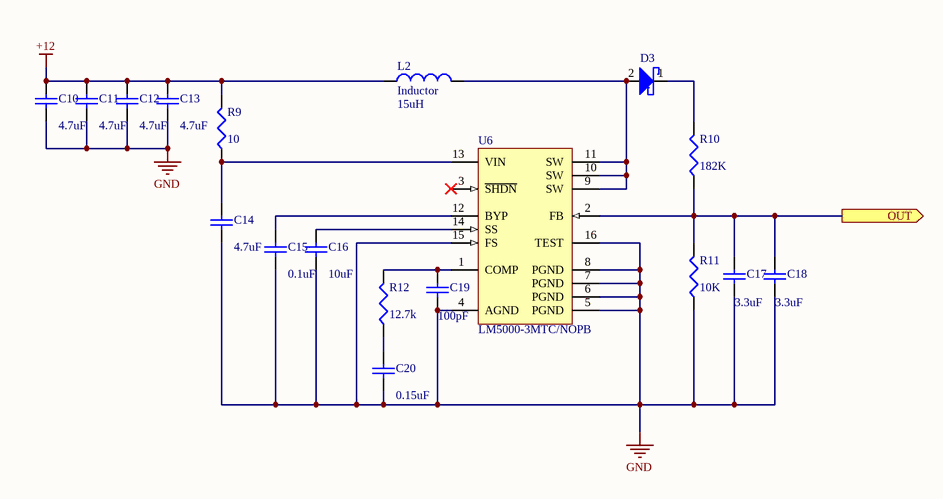
[diagram p8: BoostConverter.SchDoc]

### Parts
C10  Cap  [C0805]  (value not drawn)
C11  Cap  [C0805]  (value not drawn)
C12  Cap  [C0805]  (value not drawn)
C13  Cap  [C0805]  (value not drawn)
C14  Cap  [C0805]  (value not drawn)
C15  Cap  [C0805]  (value not drawn)
C16  Cap  [C0805]  (value not drawn)
C17  Cap  [C0805]  (value not drawn)
C18  Cap  [C0805]  (value not drawn)
C19  Cap  [C0805]  (value not drawn)
C20  Cap  [C0805]  (value not drawn)
D3  Schottky Diode  [DIOM4326X24N]  (value not drawn)
L2  Inductor  value 15uH  [INDC4532]
R9  value 10  [J1-0603]  (hidden comment: Res3)
R10  value 182K  [J1-0603]  (hidden comment: Res3)
R11  value 10K  [J1-0603]  (hidden comment: Res3)
R12  value 12.7k  [6-0805_L]  (hidden comment: Res3)
U6  LM5000-3MTC/NOPB  [PW0016A_L]

### Ports
OUT (out)

### Nets
+12: C10.2 C11.2 C12.2 C13.2 L2.1 R9.2
GND: C10.1 C11.1 C12.1 C13.1 C14.1 C15.1 C16.1 C17.1 C18.1 C19.1 C20.1 R11.1 U6.4(AGND) U6.5(PGND) U6.6(PGND) U6.7(PGND) U6.8(PGND) U6.15(FS) U6.16(TEST)
NetC14_2: C14.2 R9.1 U6.13(VIN)
NetC15_2: C15.2 U6.12(BYP)
NetC16_2: C16.2 U6.14(SS)
NetC17_2: C17.2 C18.2 R10.1 R11.2 U6.2(FB) ; port OUT
NetC19_2: C19.2 R12.2 U6.1(COMP)
NetC20_2: C20.2 R12.1
NetD3_1: D3.1 R10.2
NetD3_2: D3.2 L2.2 U6.9(SW) U6.10(SW) U6.11(SW)

Not connected (* = marked no-connect by the designer): U6 3(~{SHDN})*

### Notes on the sheet
- (in symbol Cap) 4.7uF; 0.1uF; 10uF; 100pF; 0.15uF; 3.3uF

### Library data of the parts
C10-C20 = Cap: Capacitor; Published: 8-Jun-2000; LatestRevisionDate: 17-Jul-2002; LatestRevisionNote: Re-released for DXP Platform.; PackageReference: RAD-0.3; Publisher: Altium Limited; PackageDescription: Radial Cap, Thru-Hole; 2 Leads; 0.3 in Pin Spacing
D3 = B160-13-F
L2 = Inductor: Code_IEC: 1005; Published: 8-Jun-2000; LatestRevisionDate: 29-May-2009; LatestRevisionNote: IPC-7351 Footprint Added.; PackageReference: 0402-A; Publisher: Altium Limited; PackageDescription: Chip Inductor; Code_JEITA: 0402
R9-R12 = Res3: Resistor; Published: 8-Jun-2000; LatestRevisionDate: 29-May-2009; LatestRevisionNote: IPC-7351 Footprint Added.; PackageReference: J1-0603; Publisher: Altium Limited; PackageDescription: Chip Resistor
U6 = CMP-0069-01337-3: High Voltage Switch Mode Regulator, 16-pin TSSOP, Pb-Free; Manufacturer: Texas Instruments; PowerWise: N; CompType: Switcher; PackageTopMarking: NSZXYTT*LM5000*3MTC; PackageReference: PW0016A; Code_JEDEC: MO-153-AB; PinCount: 16; RoHS: Y; ComponentLink1URL: http://www.ti.com/general/docs/lit/getliterature.tsp?genericPartNumber=LM5000&fileType=pdf; PackageDescription: Molded TSSOP, Jedec, 5 x 4.4 x 0.9mm Body, 16 Lead, 0.65mm Pitch; ComponentLink1Description: Datasheet URL

## Nets that join several sheets
3.3V: Dashboard (C5.1 U3.5), LCD (6 pins)
+12: Dashboard (6 pins), HD1 (Q1_HD1.2), HD2 (Q1_HD2.2), HD3 (Q1_HD3.2), BoostConverter (6 pins)
GND: Dashboard (11 pins), HD1 (Q2_HD1.2), HD2 (Q2_HD2.2), HD3 (Q2_HD3.2), LCD (28 pins), LED_Power_Ind (LED1.2), AT90CAN128 (5 pins), FTDI_Interface (7 pins), CAN_Interface (D2.3 R6.1 U5.2), ResetCkt (C24.1 JP1.2), BoostConverter (19 pins)
VCC: Dashboard (C6.1 U4.2), LCD (U7.14), LED_Power_Ind (R5.2), AT90CAN128 (L1.2 U1#2.21 U1#2.52), FTDI_Interface (6 pins), CAN_Interface (U5.3), ResetCkt (D4.2 R14.2)
CAN0.CAN_N: Dashboard (X1.5), CAN_Interface (D2.2 U5.6)
CAN0.CAN_P: Dashboard (X1.4), CAN_Interface (D2.1 U5.7)
NetC17_2: LCD (J1.39), BoostConverter (5 pins)
NetR3_2: AT90CAN128 (U1#2.2), FTDI_Interface (R3.2)
NetR4_2: AT90CAN128 (U1#2.3), FTDI_Interface (R4.2)
Reset: AT90CAN128 (U1#2.20), FTDI_Interface (C3.1), ResetCkt (C24.2 D4.1 JP1.1 R14.1)
RXCAN: AT90CAN128 (U1#2.31), CAN_Interface (U5.4)
TXCAN: AT90CAN128 (U1#2.30), CAN_Interface (U5.1)